# Altium schematic sheet ADXL192(AD22282_AD22283).SchDoc
size A4
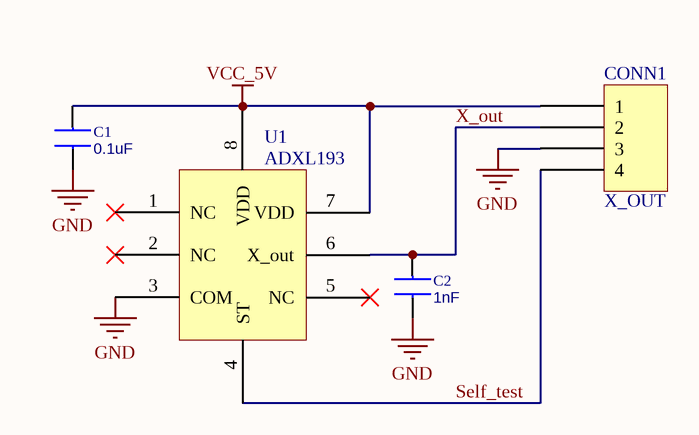
[diagram p0: ADXL192(AD22282_AD22283).SchDoc]

## Parts
C1  0.1uF  [C_0805]
C2  1nF  [C_0805]
CONN1  X_OUT  [4_pin_plate_conn]
U1  ADXL193  [E-8-1]

## Nets
GND: C1.1 C2.1 CONN1.3 U1.3(COM)
VCC_5V: C1.2 CONN1.1 U1.7(VDD) U1.8(VDD)
Self_test: CONN1.4 U1.4(ST)
X_out: C2.2 CONN1.2 U1.6(X_out)

Not connected (* = marked no-connect by the designer): U1 1(NC)* 2(NC)* 5(NC)*

## Library data of the parts
C1 C2 = C0805: Capacitor
  C1: Value: 0.1uF
  C2: Value: 1nF
CONN1 = 4_pin_plate_conn
U1 = ADXL193: Analog devices accelerometer